# Altium schematic sheet Eink_Smartwatch_v1.SchDoc
size A2; SheetNumber: 1; SheetTotal: 1
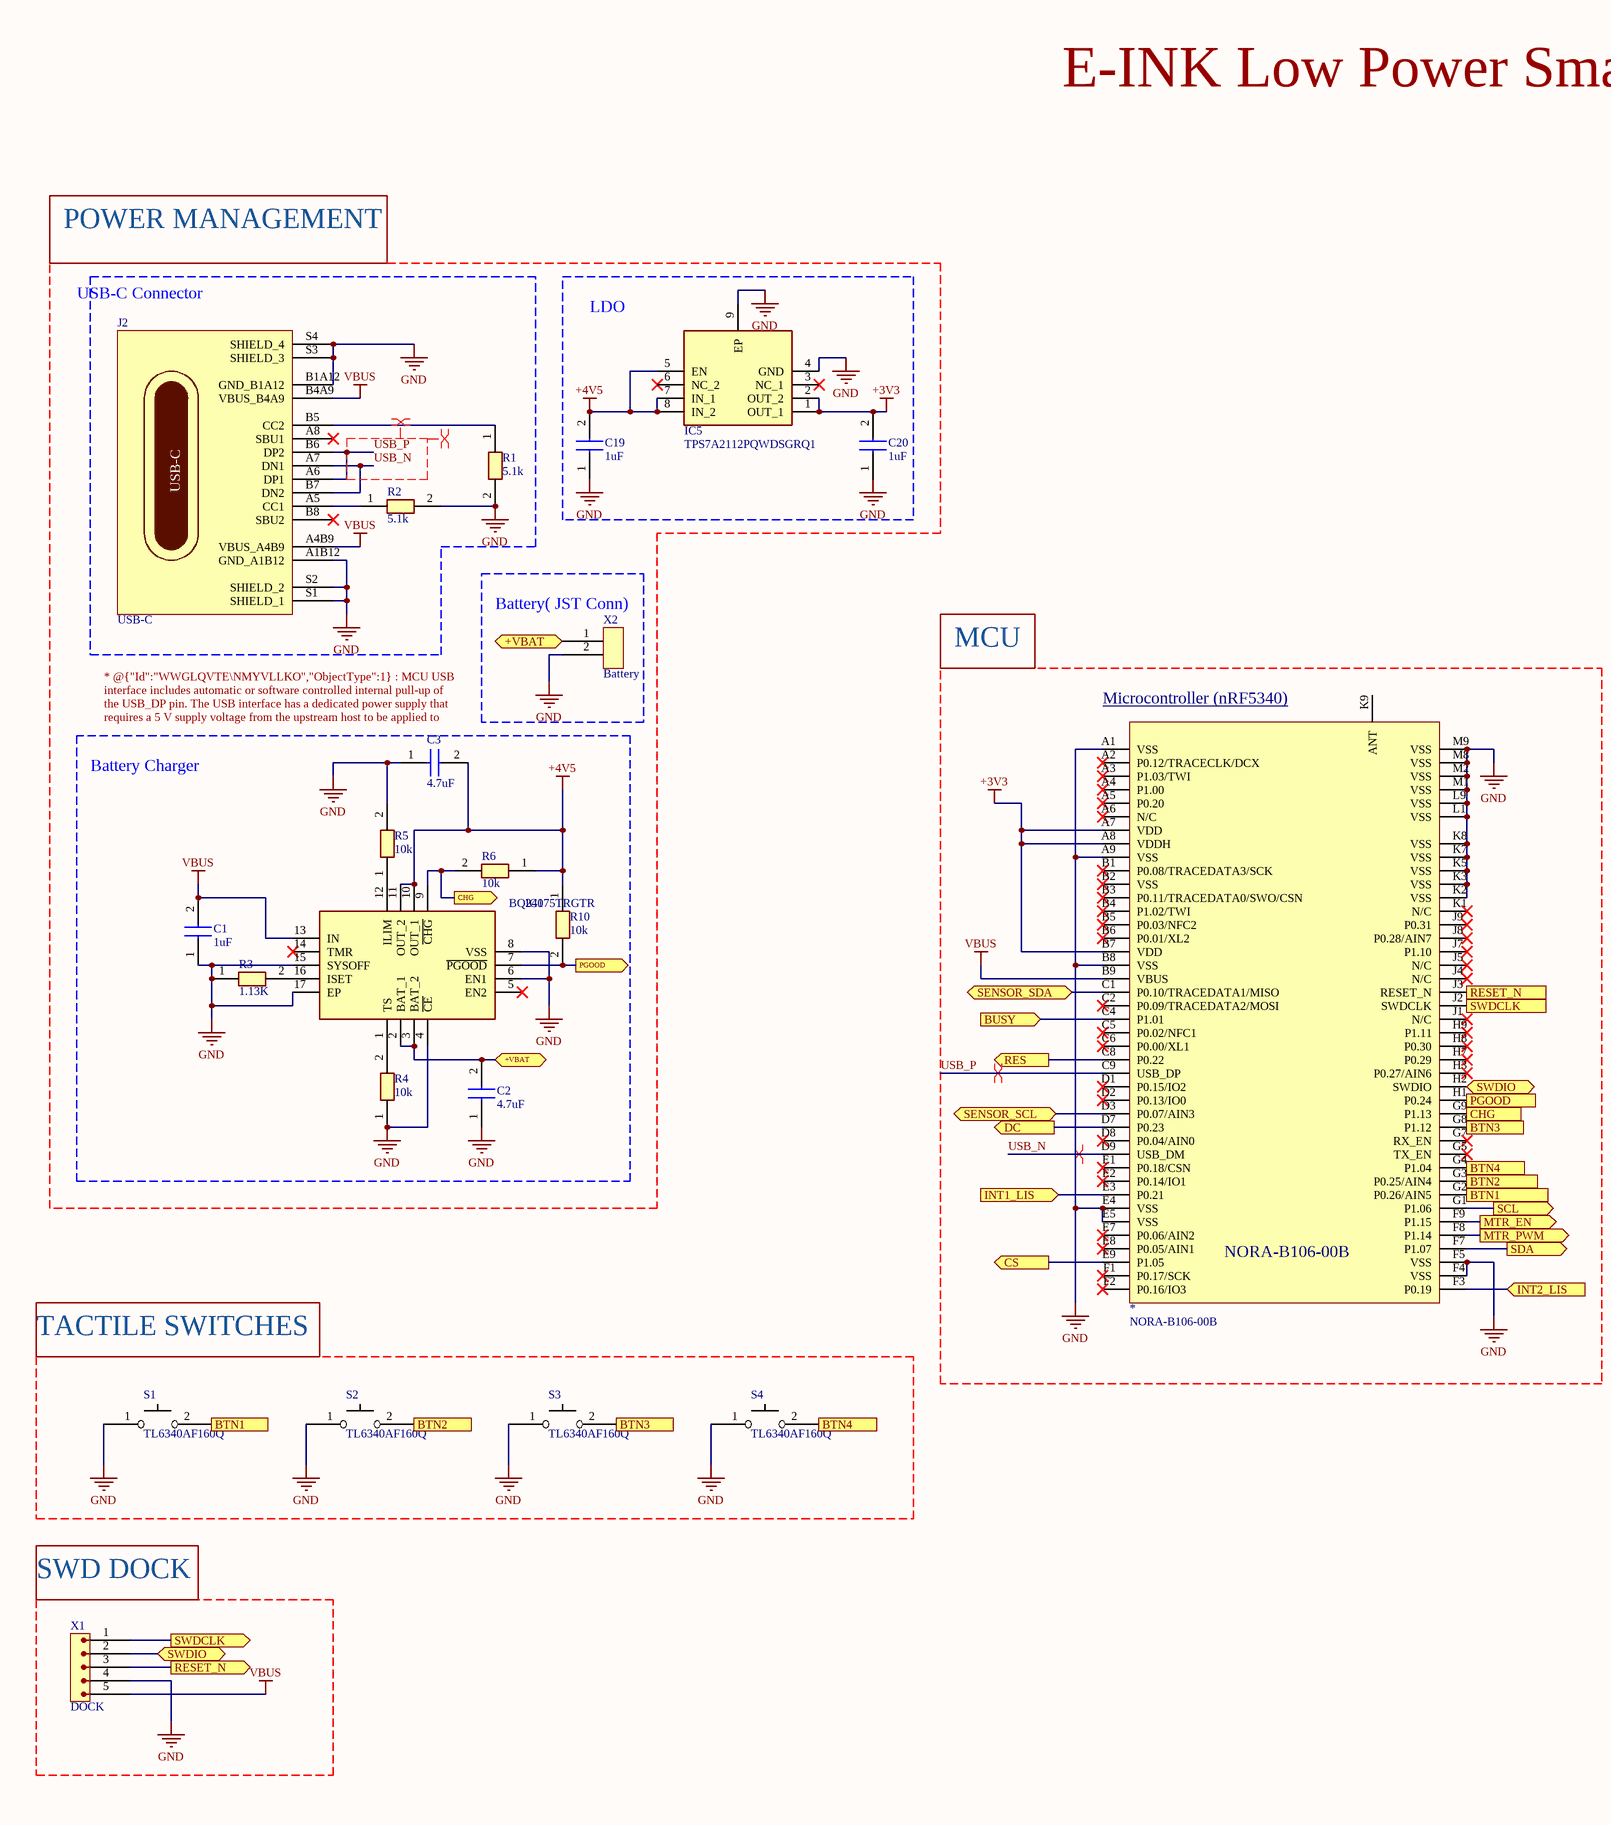
[diagram p0: Eink_Smartwatch_v1.SchDoc, left]
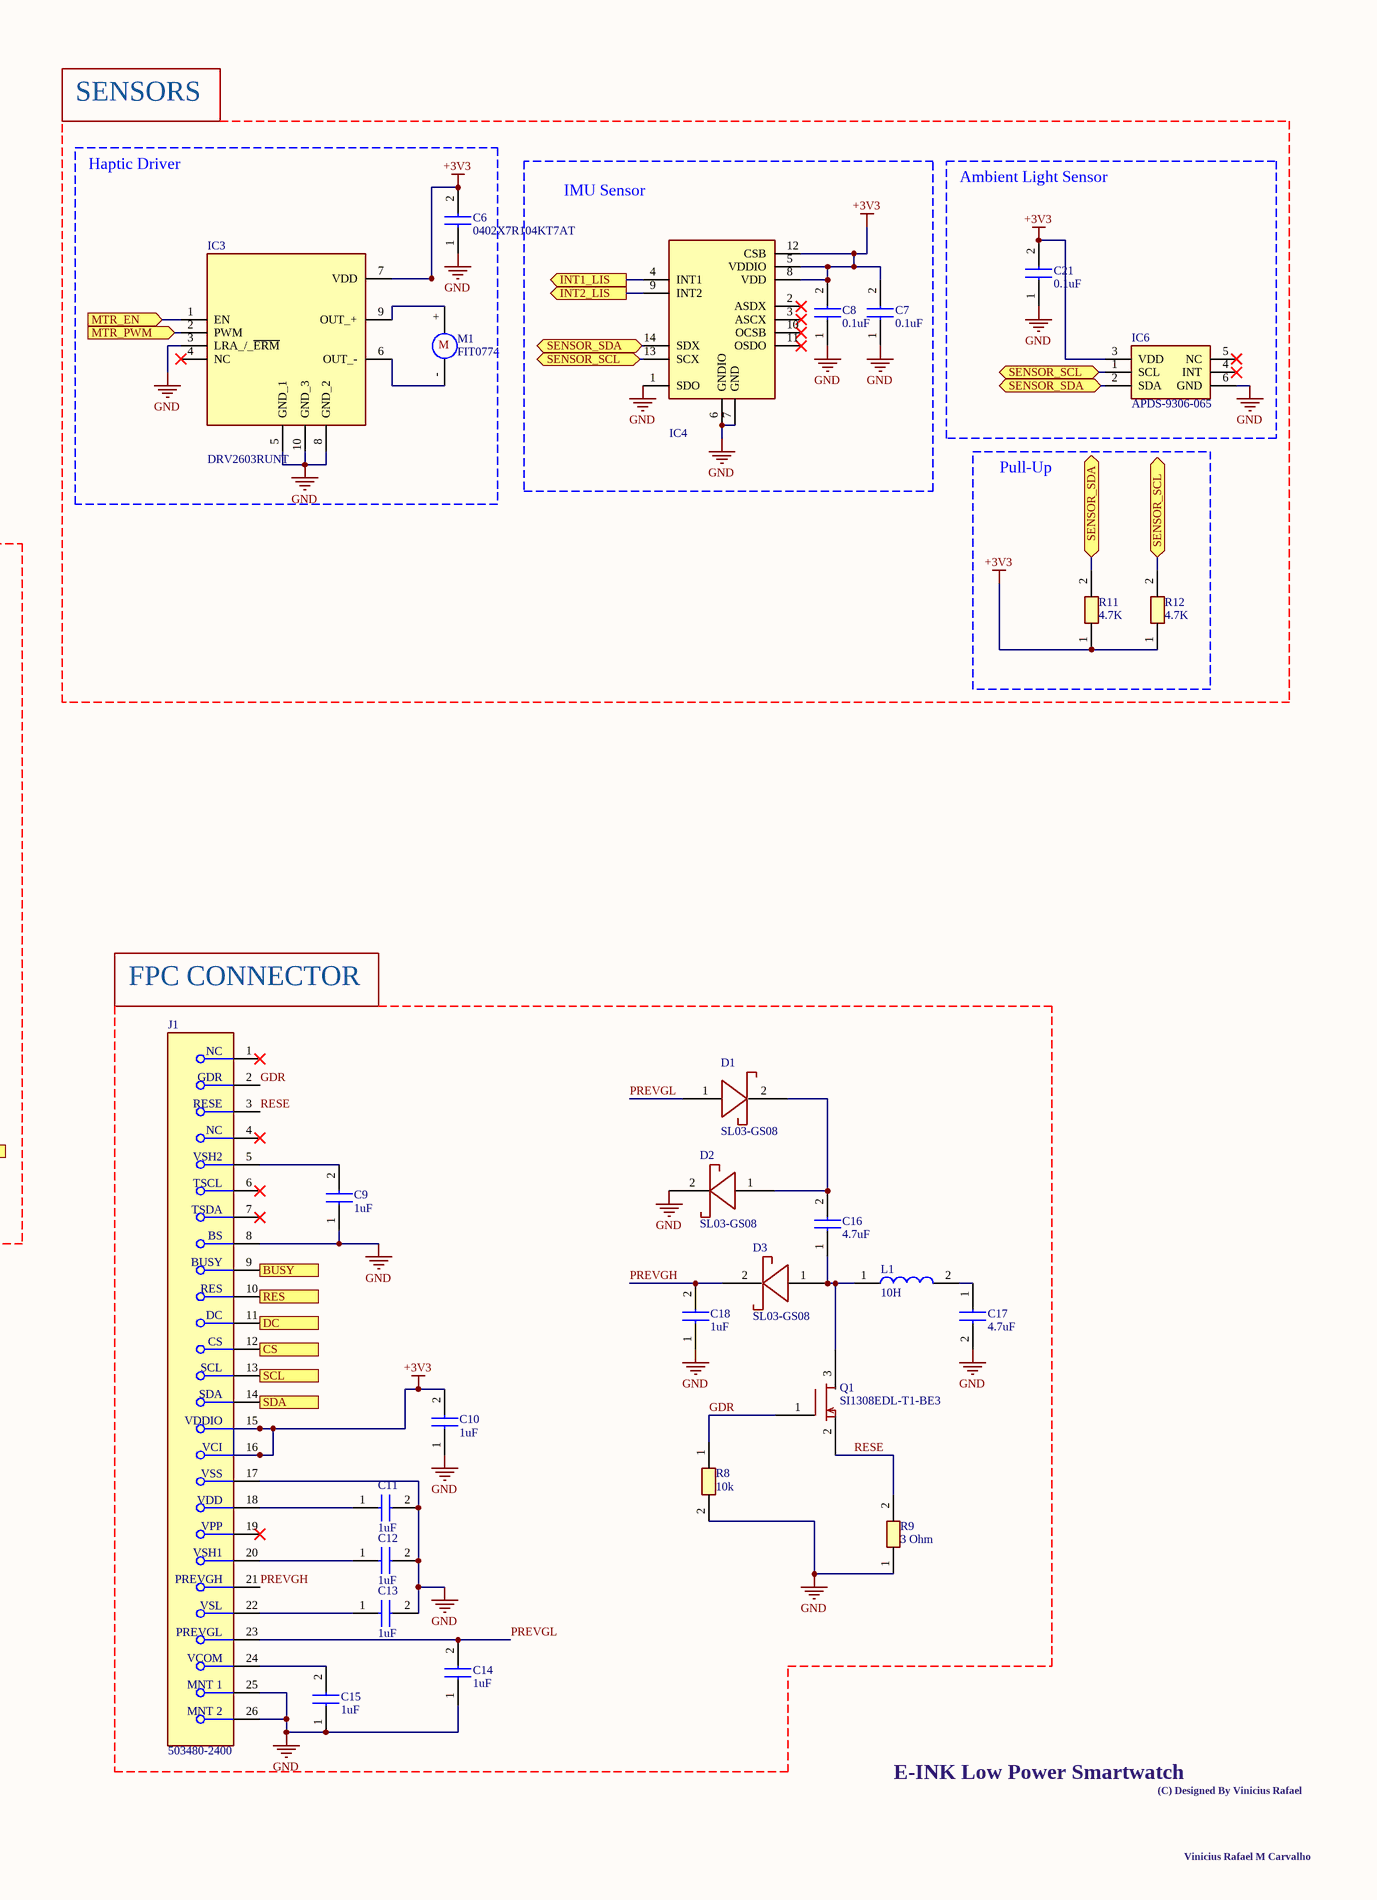
[diagram p1: Eink_Smartwatch_v1.SchDoc, right]

## Parts
*  NORA-B106-00B  [XCVR_NORA-B106-00B]
C1  1uF  [CAPC1005X65N]
C2  4.7uF  [CAPC1005X65N]
C3  4.7uF  [CAPC1005X65N]
C6  0402X7R104KT7AT  [CAPC1005X61N]
C7  0.1uF  [CAPC1005X61N]
C8  0.1uF  [CAPC1005X61N]
C9  1uF  [CAPC1005X65N]
C10  1uF  [CAPC1005X65N]
C11  1uF  [CAPC1005X65N]
C12  1uF  [CAPC1005X65N]
C13  1uF  [CAPC1005X65N]
C14  1uF  [CAPC1005X65N]
C15  1uF  [CAPC1005X65N]
C16  4.7uF  [CAPC1005X65N]
C17  4.7uF  [CAPC1005X65N]
C18  1uF  [CAPC1005X65N]
C19  1uF  [CAPC1005X65N]
C20  1uF  [CAPC1005X65N]
C21  0.1uF  [CAPC1005X61N]
D1  SL03-GS08  [SODFL3718X108N]
D2  SL03-GS08  [SODFL3718X108N]
D3  SL03-GS08  [SODFL3718X108N]
IC1  BQ24075TRGTR  [QFN50P300X300X100-17N-D]
IC3  DRV2603RUNT  [QFN50P200X200X80-10N-D]
IC4  BMI270  [BMI270]  (value not drawn)
IC5  TPS7A2112PQWDSGRQ1  [SON50P200X200X80-9N]
IC6  APDS-9306-065  [APDS9306065]
J1  503480-2400  [MOLEX_5034802400]
J2  USB-C  [FP-2171790001-MFG]
L1  10H  [DFE2HCAH1R0MJ0L]
M1  FIT0774  [FIT0774]
Q1  SI1308EDL-T1-BE3  [SI1308EDL-T1-BE3]
R1  5.1k  [RESC1005X40]
R2  5.1k  [RESC1005X40]
R3  1.13K  [RESC1005X37N]
R4  10k  [RESC1005X37N]
R5  10k  [RESC1005X37N]
R6  10k  [RESC1005X37N]
R8  10k  [RESC1005X37N]
R9  3 Ohm  [RESC1508X50N]
R10  10k  [RESC1005X37N]
R11  4.7K  [ERJPA2_(0402)]
R12  4.7K  [ERJPA2_(0402)]
S1  TL6340AF160Q  [SW_TL6340AF160Q]
S2  TL6340AF160Q  [SW_TL6340AF160Q]
S3  TL6340AF160Q  [SW_TL6340AF160Q]
S4  TL6340AF160Q  [SW_TL6340AF160Q]
X1  DOCK  [SAMTEC_FTSH-105-XX-X-DV]
X2  Battery  [JST_PHR-2]

## Blocks framed on the sheet
LDO: C19 C20 IC5
Haptic Driver: C6 IC3 M1
IMU Sensor: C7 C8 IC4
Ambient Light Sensor: C21 IC6
Battery( JST Conn): X2
Pull-Up: R11 R12
MCU: *
Battery Charger: C1-C3 IC1 R3-R6 R10
TACTILE SWITCHES: S1-S4
SWD DOCK: X1

## Ports
+VBAT (bidir, see Eink_Smartwatch_v1[2B]), +VBAT (bidir, see Eink_Smartwatch_v1[2C]), BTN1 (in, see Eink_Smartwatch_v1[1C]), BTN1 (out, see Eink_Smartwatch_v1[5C]), BTN2 (in, see Eink_Smartwatch_v1[2C]), BTN2 (out, see Eink_Smartwatch_v1[5C]), BTN3 (in, see Eink_Smartwatch_v1[2C]), BTN3 (out, see Eink_Smartwatch_v1[5C]), BTN4 (in, see Eink_Smartwatch_v1[3C]), BTN4 (out, see Eink_Smartwatch_v1[5C]), BUSY (in, see Eink_Smartwatch_v1[6C]), BUSY (out, see Eink_Smartwatch_v1[3C]), CHG (in, see Eink_Smartwatch_v1[2B]), CHG (out, see Eink_Smartwatch_v1[5C]), CS (in, see Eink_Smartwatch_v1[3C]), CS (out, see Eink_Smartwatch_v1[6C]), DC (in, see Eink_Smartwatch_v1[3C]), DC (out, see Eink_Smartwatch_v1[6C]), INT1_LIS (in, see Eink_Smartwatch_v1[6A]), INT1_LIS (out, see Eink_Smartwatch_v1[3C]), INT2_LIS (in, see Eink_Smartwatch_v1[6A]), INT2_LIS (out, see Eink_Smartwatch_v1[5C]), MTR_EN (in, see Eink_Smartwatch_v1[5C]), MTR_EN (out, see Eink_Smartwatch_v1[5A]), MTR_PWM (in, see Eink_Smartwatch_v1[5C]), MTR_PWM (out, see Eink_Smartwatch_v1[5A]), PGOOD (in, see Eink_Smartwatch_v1[2B]), PGOOD (out, see Eink_Smartwatch_v1[5C]), RES (in, see Eink_Smartwatch_v1[3C]), RES (out, see Eink_Smartwatch_v1[6C]), RESET_N (in, see Eink_Smartwatch_v1[1D]), RESET_N (out, see Eink_Smartwatch_v1[5B]), SCL (in, see Eink_Smartwatch_v1[5C]), SCL (out, see Eink_Smartwatch_v1[6C]), SDA (in, see Eink_Smartwatch_v1[5C]), SDA (out, see Eink_Smartwatch_v1[6D]), SENSOR_SCL (bidir, see Eink_Smartwatch_v1[3C], Eink_Smartwatch_v1[6B], Eink_Smartwatch_v1[8B]), SENSOR_SCL (bidir, see Eink_Smartwatch_v1[3C], Eink_Smartwatch_v1[8B]), SENSOR_SCL (bidir, see Eink_Smartwatch_v1[6B], Eink_Smartwatch_v1[8B]), SENSOR_SDA (bidir, see Eink_Smartwatch_v1[3B], Eink_Smartwatch_v1[6A], Eink_Smartwatch_v1[8B]), SENSOR_SDA (bidir, see Eink_Smartwatch_v1[3B], Eink_Smartwatch_v1[8B]), SENSOR_SDA (bidir, see Eink_Smartwatch_v1[6A], Eink_Smartwatch_v1[8B]), SWDCLK (in, see Eink_Smartwatch_v1[1D]), SWDCLK (out, see Eink_Smartwatch_v1[5C]), SWDIO (bidir, see Eink_Smartwatch_v1[1D]), SWDIO (bidir, see Eink_Smartwatch_v1[5C])

## Nets
+3V3: *.A7(VDD) *.A8(VDDH) *.B7(VDD) C6.2 C7.2 C8.2 C10.2 C20.2 C21.2 IC3.7(VDD) IC4.5(VDDIO) IC4.8(VDD) IC4.12(CSB) IC5.1(OUT_1) IC5.2(OUT_2) IC6.3(VDD) J1.15 J1.16 R11.1 R12.1
+4V5: C3.2 C19.2 IC1.10(OUT_1) IC1.11(OUT_2) IC5.5(EN) IC5.7(IN_1) IC5.8(IN_2) R6.1 R10.1
GND: *.A1(VSS) *.A9(VSS) *.B8(VSS) *.E4(VSS) *.E5(VSS) *.F4(VSS) *.F5(VSS) *.K2(VSS) *.K3(VSS) *.K5(VSS) *.K7(VSS) *.K8(VSS) *.L1(VSS) *.L9(VSS) *.M1(VSS) *.M2(VSS) *.M8(VSS) *.M9(VSS) C1.1 C2.1 C3.1 C6.1 C7.1 C8.1 C9.1 C10.1 C11.2 C12.2 C13.2 C14.1 C15.1 C17.2 C18.1 C19.1 C20.1 C21.1 D2.2 IC1.4(~{CE}) IC1.6(EN1) IC1.8(VSS) IC1.15(SYSOFF) IC1.17(EP) IC3.3(LRA_/_~{ERM}) IC3.5(GND_1) IC3.8(GND_2) IC3.10(GND_3) IC4.1(SDO) IC4.6(GNDIO) IC4.7(GND) IC5.4(GND) IC5.9(EP) IC6.6(GND) J1.8 J1.17 J1.25(MNT_1) J1.26(MNT_2) J2.A1B12(GND_A1B12) J2.B1A12(GND_B1A12) J2.S1(SHIELD_1) J2.S2(SHIELD_2) J2.S3(SHIELD_3) J2.S4(SHIELD_4) R1.2 R2.2 R3.1 R4.1 R5.2 R8.2 R9.1 S1.1 S2.1 S3.1 S4.1 X1.4 X2.2
VBUS: *.B9(VBUS) C1.2 IC1.13(IN) J2.A4B9(VBUS_A4B9) J2.B4A9(VBUS_B4A9) X1.5
+VBAT: C2.2 IC1.2(BAT_1) IC1.3(BAT_2) X2.1 ; port +VBAT
BTN1: *.G2(P0.26/AIN5) S1.2 ; port BTN1
BTN2: *.G3(P0.25/AIN4) S2.2 ; port BTN2
BTN3: *.G8(P1.12) S3.2 ; port BTN3
BTN4: *.G4(P1.04) S4.2 ; port BTN4
BUSY: *.C4(P1.01) J1.9 ; port BUSY
CHG: *.G9(P1.13) IC1.9(~{CHG}) R6.2 ; port CHG
CS: *.E9(P1.05) J1.12 ; port CS
DC: *.D7(P0.23) J1.11 ; port DC
GDR: J1.2 Q1.1 R8.1
INT1_LIS: *.E3(P0.21) IC4.4(INT1) ; port INT1_LIS
INT2_LIS: *.F3(P0.19) IC4.9(INT2) ; port INT2_LIS
MTR_EN: *.F9(P1.15) IC3.1(EN) ; port MTR_EN
MTR_PWM: *.F8(P1.14) IC3.2(PWM) ; port MTR_PWM
PGOOD: *.H1(P0.24) IC1.7(~{PGOOD}) R10.2 ; port PGOOD
PREVGH: C18.2 D3.2 J1.21
PREVGL: C14.2 D1.1 J1.23
RES: *.C8(P0.22) J1.10 ; port RES
RESE: J1.3 Q1.2 R9.2
RESET_N: *.J3(RESET_N) X1.3 ; port RESET_N
SCL: *.G1(P1.06) J1.13 ; port SCL
SDA: *.F7(P1.07) J1.14 ; port SDA
SENSOR_SCL: *.D3(P0.07/AIN3) IC4.13(SCX) IC6.1(SCL) R12.2 ; port SENSOR_SCL
SENSOR_SDA: *.C1(P0.10/TRACEDATA1/MISO) IC4.14(SDX) IC6.2(SDA) R11.2 ; port SENSOR_SDA
SWDCLK: *.J2(SWDCLK) X1.1 ; port SWDCLK
SWDIO: *.H2(SWDIO) X1.2 ; port SWDIO
USB_N: *.D9(USB_DM) J2.A7(DN1) J2.B7(DN2)
USB_P: *.C9(USB_DP) J2.A6(DP1) J2.B6(DP2)
NetC9_2: C9.2 J1.5
NetC11_1: C11.1 J1.18
NetC12_1: C12.1 J1.20
NetC13_1: C13.1 J1.22
NetC15_2: C15.2 J1.24
NetC16_1: C16.1 D3.1 L1.1 Q1.3
NetC16_2: C16.2 D1.2 D2.1
NetC17_1: C17.1 L1.2
NetIC1_1: IC1.1(TS) R4.2
NetIC1_12: IC1.12(ILIM) R5.1
NetIC1_16: IC1.16(ISET) R3.2
NetIC3_6: IC3.6(OUT_-) M1.-
NetIC3_9: IC3.9(OUT_+) M1.+
NetJ2_A5: J2.A5(CC1) R2.1
NetJ2_B5: J2.B5(CC2) R1.1

Not connected (* = marked no-connect by the designer): * A2(P0.12/TRACECLK/DCX)* A3(P1.03/TWI)* A4(P1.00)* A5(P0.20)* A6(N/C)* B1(P0.08/TRACEDATA3/SCK)* B2(VSS)* B3(P0.11/TRACEDATA0/SWO/CSN)* B4(P1.02/TWI)* B5(P0.03/NFC2)* B6(P0.01/XL2)* C2(P0.09/TRACEDATA2/MOSI)* C5(P0.02/NFC1)* C6(P0.00/XL1)* D1(P0.15/IO2)* D2(P0.13/IO0)* D8(P0.04/AIN0)* E1(P0.18/CSN)* E2(P0.14/IO1)* E7(P0.06/AIN2)* E8(P0.05/AIN1)* F1(P0.17/SCK)* F2(P0.16/IO3)* G5(TX_EN)* G7(RX_EN)* H3(P0.27/AIN6)* H7(P0.29)* H8(P0.30)* H9(P1.11)* J1(N/C)* J4(N/C)* J5(N/C)* J7(P1.10)* J8(P0.28/AIN7)* J9(P0.31)* K1(N/C)* K9(ANT); IC1 5(EN2)* 14(TMR)*; IC3 4(NC)*; IC4 2(ASDX)* 3(ASCX)* 10(OCSB)* 11(OSDO)*; IC5 3(NC_1)* 6(NC_2)*; IC6 4(INT)* 5(NC)*; J1 1* 4* 6* 7* 19*; J2 A8(SBU1)* B8(SBU2)*

## Layout directives
differential pair: USB_N, USB_P
differential pair; differential pair class DIFF90: USB_N, USB_P
net class DIFF90: USB_N, USB_P

## Notes on the sheet
- E-INK Low Power Smartwatch
- POWER MANAGEMENT
- SENSORS
- USB-C Connector
- (near C3) * @{"Id":"WWGLQVTE\NMYVLLKO","ObjectType":1} : MCU USB interface includes automatic or software controlled internal pull-up of the USB_DP pin. The USB interface has a dedicated power supply that requires a 5 V supply voltage from the upstream host to be applied to the VBUS pin.
- (near *) Microcontroller (nRF5340) <https://br.mouser.com/datasheet/2/1025/NORA_B1_DataSheet_UBX_20027119-3180474.pdf>
- FPC CONNECTOR
- (C) Designed By Vinicius Rafael
- Vinicius Rafael M Carvalho
- (in symbol CMP-00257-81652754-1) NC; GDR; RESE; VSH2; TSCL; TSDA; BS; BUSY; RES; DC; CS; SCL; SDA; VDDIO; VCI; VSS; VDD; VPP; VSH1; PREVGH; VSL; PREVGL; VCOM
- (in symbol FIT0774) M

## Library data of the parts
* = NORA-B106-00B: Bluetooth Modules - 802.15.1 nRF5340, PCB antenna, open CPU; Manufacturer: u-blox; Supplier: Mouser; Supplier Part Number: 377-NORA-B106-00B; Manufacturer Part Number: NORA-B106-00B; RoHS: No; Category: LDO; Stock: 4440; Pricing: 1=14, 10=12,74, 50=11,72, 100=10,9, 1000=10,9, 10000=10,9 (USD); ComponentLink1URL: https://datasheet.octopart.com/NORA-B106-00B-u-blox-datasheet-166811452.pdf?src-supplier=TME; ComponentLink1Description: https://datasheet.octopart.com/NORA-B106-00B-u-blox-datasheet-166811452.pdf?src-supplier=TME
C1 C9-C15 C18-C20 = CC0402KRX5R6BB105: Multilayer Ceramic Capacitors MLCC - SMD/SMT 10V 1uF X5R 0402 10% HI CV; Manufacturer_Name: YAGEO; Datasheet Link: https://www.yageo.com/upload/media/product/app/datasheet/mlcc/upy-gphc_x5r_4v-to-50v.pdf; Height: 0.55mm; Manufacturer_Part_Number: CC0402KRX5R6BB105; Mouser Part Number: 603-CC402KRX5R6BB105; Mouser Price/Stock: https://www.mouser.co.uk/ProductDetail/YAGEO/CC0402KRX5R6BB105?qs=BKNoF%2F0xMNu0TvpE6ze2Iw%3D%3D; Arrow Part Number: CC0402KRX5R6BB105; Arrow Price/Stock: https://www.arrow.com/en/products/cc0402krx5r6bb105/yageo?region=nac
C2 C3 C16 C17 = GRM31CR61A475KA01L: Multilayer Ceramic Capacitors MLCC - SMD/SMT 4.7 uF 10 VDC 20% 0402 X5R; Manufacturer_Name: Murata Electronics; Datasheet Link: http://www.murata.com/~/media/webrenewal/support/library/catalog/products/capacitor/mlcc/c02e.pdf; Height: 1.8mm; Manufacturer_Part_Number: GRM31CR61A475KA01L; Mouser Part Number: 81-GRM426R475K10L; Mouser Price/Stock: https://www.mouser.co.uk/ProductDetail/Murata-Electronics/GRM31CR61A475KA01L?qs=v6FXEKp3YeVDfOIVbbYCqg%3D%3D; Arrow Part Number: GRM31CR61A475KA01L; Arrow Price/Stock: https://www.arrow.com/en/products/grm31cr61a475ka01l/murata-manufacturing
C6-C8 C21 = 0402X7R104KT7AT: Multilayer Ceramic Capacitors MLCC - SMD/SMT 16V 0.1uF X7R 10%; Manufacturer_Name: Kyocera AVX; Datasheet Link: https://www.mouser.es/datasheet/2/40/general_purpose-3169586.pdf; Height: 0.61mm; Manufacturer_Part_Number: 0402X7R104KT7AT; Mouser Part Number: 581-0402X7R104KT7AT; Mouser Price/Stock: https://www.mouser.co.uk/ProductDetail/KYOCERA-AVX/0402X7R104KT7AT?qs=DPoM0jnrROXD467pFR2ukA%3D%3D
D1-D3 = SL03-GS08: Rectifier Diode, Schottky, 1 Phase, 1 Element, 1.1A, 30V V(RRM), Silicon, DO-219AB; Manufacturer: Vishay Semiconductors; Package Body Material: Plastic; Application(s): EFFICIENCY; Forward Voltage: 430mV; Non-rep Pk Forward Current-Max: 40A; Number of Elements: 1; Qualification Status: Not Qualified; Supplier: Mouser; Supplier Part Number: 625-SL03; Manufacturer Part Number: SL03-GS08; RoHS: Yes; Category: Rectifier Diodes; Stock: 88607; Pricing: 1=0,41, 10=0,274, 50=0,339, 100=0,185, 500=0,144, 1000=0,13, 3000=0,099, 9000=0,089, 10000=0,092, 24000=0,087 (USD); Pins: 2; Diode Element Material: SILICON; Package Shape: Rectangular; Terminal Finish: Tin; Max Operating Temperature: 125°C; JESD-609 Code: e3; Diode Type: RECTIFIER; JESD-30 Code: R-PDSO-F2; Moisture Sensitivity Level: 1; Number of Phases: 1; Max Output current: 1.1A; Package Style: SMALL OUTLINEMeter; Rep Pk Reverse Voltage-Max: 30V; Surface Mount: Yes; Technology: SCHOTTKY; Terminal Form: Flat; Terminal Position: DUAL; JEDEC-95 Code: DO-219AB; RoHS Compliant: Yes; Reach SVHC Compliant: No; ComponentLink1URL: https://datasheet.ciiva.com:443/pdfs/VipMasterIC/IC/VISH/VISH-S-A0009169378/VISH-S-A0009169378-1.pdf?src-supplier=IHS+Markit; ComponentLink1Description: https://datasheet.ciiva.com:443/pdfs/VipMasterIC/IC/VISH/VISH-S-A0009169378/VISH-S-A0009169378-1.pdf?src-supplier=IHS+Markit; ComponentLink2URL: https://datasheet.ciiva.com/910/sl02-03-04-910861.pdf?src-supplier=Digikey; ComponentLink2Description: https://datasheet.ciiva.com/910/sl02-03-04-910861.pdf?src-supplier=Digikey; ComponentLink3URL: https://datasheet.ciiva.com/910/sl02-910862.pdf?src-supplier=Digikey; ComponentLink3Description: https://datasheet.ciiva.com/910/sl02-910862.pdf?src-supplier=Digikey; ComponentLink4URL: https://datasheet.ciiva.com/910/sl02-910863.pdf?src-supplier=Digikey; ComponentLink4Description: https://datasheet.ciiva.com/910/sl02-910863.pdf?src-supplier=Digikey; ComponentLink5URL: https://datasheet.ciiva.com/8290/sl02-8290522.pdf?src-supplier=Avnet; ComponentLink5Description: https://datasheet.ciiva.com/8290/sl02-8290522.pdf?src-supplier=Avnet; ComponentLink6URL: https://datasheet.ciiva.com/16486/sl02-16486940.pdf?src-supplier=Future+Electronics; ComponentLink6Description: https://datasheet.ciiva.com/16486/sl02-16486940.pdf?src-supplier=Future+Electronics
IC1 = BQ24075TRGTR: Gerenciadores de bateria 1.5A USB-Friendly Li Ion Batt Charger; Manufacturer_Name: Texas Instruments; Datasheet Link: http://componentsearchengine.com/Datasheets/1/BQ24075TRGTR.pdf; Height: 1mm; Manufacturer_Part_Number: BQ24075TRGTR; Mouser Part Number: 595-BQ24075TRGTR; Mouser Price/Stock: https://www.mouser.co.uk/ProductDetail/Texas-Instruments/BQ24075TRGTR?qs=%2Fqzd9s%252BcLd4uxZAT5jNskQ%3D%3D; Arrow Part Number: BQ24075TRGTR; Arrow Price/Stock: https://www.arrow.com/en/products/bq24075trgtr/texas-instruments?region=nac
IC3 = DRV2603RUNT: Motor / Motion / Ignition Controllers & Drivers Haptic Driver w/Auto Resonance Tracking; Manufacturer_Name: Texas Instruments; Datasheet Link: http://www.ti.com/lit/ds/symlink/drv2603.pdf; Height: 0.8mm; Manufacturer_Part_Number: DRV2603RUNT; Mouser Part Number: 595-DRV2603RUNT; Mouser Price/Stock: https://www.mouser.co.uk/ProductDetail/Texas-Instruments/DRV2603RUNT?qs=y0LsnOHuQQ66fXxKAgGo4A%3D%3D; Arrow Part Number: DRV2603RUNT; Arrow Price/Stock: https://www.arrow.com/en/products/drv2603runt/texas-instruments
IC4 = BMI270: IMUs - Inertial Measurement Units Smart Ultra-Low Power Inertial Measurement Unit (IMU) for Wearable Applications; Manufacturer_Name: BOSCH; Datasheet Link: https://www.bosch-sensortec.com/media/boschsensortec/downloads/datasheets/bst-bmi270-ds000.pdf; Height: 0.87mm; Manufacturer_Part_Number: BMI270; Mouser Part Number: 262-BMI270; Mouser Price/Stock: https://www.mouser.co.uk/ProductDetail/Bosch-Sensortec/BMI270?qs=u16ybLDytRYIj%252BjQEee88A%3D%3D; Arrow Part Number: BMI270; Arrow Price/Stock: https://www.arrow.com/en/products/bmi270/bosch?utm_currency=USD&region=nac
IC5 = TPS7A2112PQWDSGRQ1: LDO Voltage Regulators Automotive, 500mA, low-noise ultra-low-IQ high-PSRR low-dropout (LDO) voltage regulator; Manufacturer_Name: Texas Instruments; Datasheet Link: https://www.ti.com/lit/gpn/tps7a21-q1; Height: 0.8mm; Manufacturer_Part_Number: TPS7A2112PQWDSGRQ1
IC6 = APDS-9306-065: Ambient Light Sensors Digital Ambient Light Sensor; Manufacturer_Name: Avago Technologies; Datasheet Link: A19870331a; Height: 0.75mm; Manufacturer_Part_Number: APDS-9306-065; Mouser Part Number: 630-APDS-9306-065; Mouser Price/Stock: https://www.mouser.co.uk/ProductDetail/Broadcom-Avago/APDS-9306-065?qs=JUmsgfbaopRTut8Cx4p19A%3D%3D
J1 = CMP-00257-81652754-1: 503480-2400 Molex 503480-2400 FFC & FPC Connectors, 0.5mm, FPC Ra Smt Dual Cont 24 Circuit,; Manufacturer Lifecycle Status: ACTIVE; Number of Contacts: 24; Voltage Rating: 50V; Plating: Gold; Current Rating: 500mA; Contact Plating: Gold; Mount: Surface Mount; Country of Origin: KR; Number of Rows: 1; Orientation: Right Angle; Lifecycle Status: Production; RoHS: Compliant; Min Operating Temperature: -40°C; Contact Material: Gold, Nickel; Max Operating Temperature: 85°C; Height: 2.07mm; Number of Circuits: 24; NexarPartId: 81652754
J2 = 217179-0001: USB Connector, 16 Contact(s), Female, Right Angle, Surface Mount Terminal, Locking, Receptacle; Manufacturer: Molex; Supplier: Mouser; Supplier Part Number: 538-217179-0001; Manufacturer Part Number: 217179-0001; RoHS: No; Category: USB Connectors; Stock: 4841; Pricing: 1=0,9, 10=0,745, 50=0,745, 100=0,622, 1000=0,622, 10000=0,446 (USD)
L1 = 1239AS-H-100M=P2: Indutores de potência - SMD 10 UH 20%; Manufacturer_Name: Murata Electronics; Datasheet Link: https://psearch.en.murata.com/inductor/product/1239AS-H-100M%23.html; Height: 1.2mm; Manufacturer_Part_Number: 1239AS-H-100M=P2; Mouser Part Number: 81-1239AS-H-100MP2; Mouser Price/Stock: https://www.mouser.co.uk/ProductDetail/Murata-Electronics/1239AS-H-100M%3dP2?qs=KuGPmAKtFKWZyoO25uKvSg%3D%3D; Arrow Part Number: 1239AS-H-100M=P2; Arrow Price/Stock: https://www.arrow.com/en/products/1239as-h-100mp2/murata-manufacturing?region=nac
M1 = FIT0774: Mini Vibration Motor (10*2.7MM); Manufacturer: DFRobot; Supplier: Mouser; Supplier Part Number: 426-FIT0774; Manufacturer Part Number: FIT0774; RoHS: No; Category: Motors and Drives; Stock: 3316; Pricing: 1=0,99, 10=0,99, 50=0,99, 100=0,99, 1000=0,99, 10000=0,99 (USD)
Q1 = SI1308EDL-T1-BE3: Transistor MOSFET N-Channel 30V 1.4A 3-Pin SOT-323; Manufacturer: Vishay; Supplier: Mouser; Supplier Part Number: 78-SI1308EDL-T1-BE3; Manufacturer Part Number: SI1308EDL-T1-BE3; RoHS: No; Stock: 79433; Pricing: 1=0,4, 10=0,276, 50=0,276, 100=0,172, 1000=0,129, 10000=0,098 (USD); ComponentLink1URL: https://datasheet.octopart.com/SI1308EDL-T1-BE3-Vishay-datasheet-151651462.pdf?src-supplier=Future+Electronics; ComponentLink1Description: https://datasheet.octopart.com/SI1308EDL-T1-BE3-Vishay-datasheet-151651462.pdf?src-supplier=Future+Electronics
R1 R2 = ERJ-2RHD512X: Fixed Resistor, Metal Glaze/thick Film, 0.063W, 5110ohm, 50V, 0.5% +/-Tol, 50ppm/Cel, Surface Mount, 0402; Manufacturer: Panasonic; Manufacturer Series: ERJ2R; Power: 63mW; Rated Temperature: 70°C; Value: 5.11kR; Temperature Coefficient: 50ppm/°C; Supplier: Mouser; Supplier Part Number: 667-ERJ-2RHD512X; Manufacturer Part Number: ERJ-2RHD512X; RoHS: Yes; Stock: 18329; Pricing: 1=0,13, 10=0,11, 50=0,11, 100=0,043, 1000=0,019, 10000=0,019 (USD); Mounting Technology: Surface Mount; Pins: 2; Package Shape: Rectangular; Case/Package: 0402; Terminal Finish: Tin; Min Operating Temperature: -55°C; Max Operating Temperature: 125°C; Tolerance: 0.5%; JESD-609 Code: e3; Resistor Type: FIXED RESISTOR; Packaging: Tape and Reel; Technology: METAL GLAZE/THICK FILM; Termination: Wraparound; Working Voltage: 50V; Reach SVHC Compliant: Yes; RoHS Compliant: Yes; ComponentLink1URL: https://datasheet.ciiva.com:443/pdfs/VipMasterCap/Capacitor/PANA/PANAS11022/PANAS11022-1.pdf?src-supplier=IHS+Markit; ComponentLink1Description: https://datasheet.ciiva.com:443/pdfs/VipMasterCap/Capacitor/PANA/PANAS11022/PANAS11022-1.pdf?src-supplier=IHS+Markit; ComponentLink2URL: https://datasheet.ciiva.com/24037/aoa0000ce2-24037669.pdf?src-supplier=Mouser; ComponentLink2Description: https://datasheet.ciiva.com/24037/aoa0000ce2-24037669.pdf?src-supplier=Mouser
R3 = AF0402FR-071K13L: Fixed Resistor, Metal Glaze/thick Film, 0.0625W, 1130ohm, 50V, 1% +/-Tol, 100ppm/Cel, Surface Mount, 0402; Manufacturer: Yageo; Additional Feature: ANTI-SULFUR; Power: 62.5mW; Rated Temperature: 70°C; Value: 1.13kR; Temperature Coefficient: 100ppm/°C; Package Height: 0.32mm; Package Length: 1mm; Package Width: 0.5mm; Reference Standard: AEC-Q200; Supplier: Mouser; Supplier Part Number: 603-AF0402FR-071K13L; Manufacturer Part Number: AF0402FR-071K13L; RoHS: Yes; Category: Chip SMD Resistors; Stock: 3100; Pricing: 1=0,15, 10=0,037, 50=0,037, 100=0,02, 1000=0,012, 10000=0,006 (USD); Mounting Technology: Surface Mount; Pins: 2; Case/Package: 0402; Min Operating Temperature: -55°C; Max Operating Temperature: 155°C; Tolerance: 1%; Resistor Type: FIXED RESISTOR; Construction: Rectangular; Package Style: SMTMeter; Packaging: Tape and Reel; Termination: Wraparound; Working Voltage: 50V; Reach SVHC Compliant: Yes; RoHS Compliant: Yes; ComponentLink1URL: https://datasheet.ciiva.com:443/pdfs/VipMasterIC/IC/YAGO/YAGO-S-A0009016998/YAGO-S-A0009016998-1.pdf?src-supplier=IHS+Markit; ComponentLink1Description: https://datasheet.ciiva.com:443/pdfs/VipMasterIC/IC/YAGO/YAGO-S-A0009016998/YAGO-S-A0009016998-1.pdf?src-supplier=IHS+Markit; ComponentLink2URL: https://www.yageo.com/upload/media/product/productsearch/datasheet/rchip/PYu-AF_51_RoHS_L_6.pdf?src-supplier=Digikey; ComponentLink2Description: https://www.yageo.com/upload/media/product/productsearch/datasheet/rchip/PYu-AF_51_RoHS_L_6.pdf?src-supplier=Digikey
R4-R6 R8 R10 = MCS0402MD1002BE100: Resistores de Filme Fino - SMD .063W 10Kohms 0.1% 0402 25ppm Auto; Manufacturer_Name: Vishay; Datasheet Link: http://www.vishay.com/docs/28705/mcx0x0xpro.pdf; Height: 0.37mm; Manufacturer_Part_Number: MCS0402MD1002BE100; Mouser Part Number: 594-MCS0402MD1002BE1; Mouser Price/Stock: https://www.mouser.co.uk/ProductDetail/Vishay-Beyschlag/MCS0402MD1002BE100?qs=3SvaY9RawMIFge2HspqWnA%3D%3D; Arrow Part Number: MCS0402MD1002BE100; Arrow Price/Stock: https://www.arrow.com/en/products/mcs0402md1002be100/vishay?region=nac
R9 = CRCW06033R00JNTA: Fixed Resistor, Metal Glaze/thick Film, 0.1W, 3ohm, 75V, 5% +/-Tol, 200ppm/Cel, Surface Mount, 0603; Manufacturer: Vishay Dale; Manufacturer Series: CRCW; Power: 100mW; Rated Temperature: 70°C; Value: 3R; Temperature Coefficient: 200ppm/°C; Package Height: 0.45mm; Package Length: 1.55mm; Package Width: 0.85mm; Reference Standard: AEC-Q200; Supplier: Mouser; Supplier Part Number: 71-CRCW0603J-3; Manufacturer Part Number: CRCW06033R00JNTA; RoHS: No; Category: Chip SMD Resistors; Stock: 24685; Pricing: 1=0,16, 10=0,111, 50=0,111, 100=0,042, 1000=0,018, 10000=0,013 (USD); Mounting Technology: Surface Mount; Pins: 2; Package Shape: Rectangular; Case/Package: 0603; Terminal Finish: Nickel; Min Operating Temperature: -55°C; Max Operating Temperature: 155°C; Tolerance: 5%; JESD-609 Code: e0; Resistor Type: FIXED RESISTOR; Construction: Chip; Package Style: SMTMeter; Packaging: Tape and Reel; Series: D/CRCW; Technology: METAL GLAZE/THICK FILM; Termination: Wraparound; Working Voltage: 75V; RoHS Compliant: No; Reach SVHC Compliant: No; ComponentLink1URL: https://datasheet.ciiva.com:443/pdfs/VipMasterIC/IC/VISH/VISH-S-A0002183699/VISH-S-A0002183699-1.pdf?src-supplier=IHS+Markit; ComponentLink1Description: https://datasheet.ciiva.com:443/pdfs/VipMasterIC/IC/VISH/VISH-S-A0002183699/VISH-S-A0002183699-1.pdf?src-supplier=IHS+Markit; ComponentLink2URL: https://datasheet.ciiva.com/2563/dcrcw-2563882.pdf?src-supplier=Digikey; ComponentLink2Description: https://datasheet.ciiva.com/2563/dcrcw-2563882.pdf?src-supplier=Digikey; ComponentLink3URL: https://datasheet.ciiva.com/9082/dcrcw-9082586.pdf?src-supplier=Avnet; ComponentLink3Description: https://datasheet.ciiva.com/9082/dcrcw-9082586.pdf?src-supplier=Avnet
R11 R12 = ERJ-PA2F4701X: Thick Film Resistors - SMD 0402 1% 4.7Kohm Anti-Surge AEC-Q200; Manufacturer_Name: Panasonic; Datasheet Link: http://industrial.panasonic.com/cdbs/www-data/pdf/RDO0000/AOA0000C331.pdf; Height: 0.4mm; Manufacturer_Part_Number: ERJ-PA2F4701X; Mouser Part Number: 667-ERJ-PA2F4701X; Mouser Price/Stock: https://www.mouser.co.uk/ProductDetail/Panasonic/ERJ-PA2F4701X?qs=h9NfwcE6J0JdNXujYyUhOg%3D%3D; Arrow Part Number: ERJ-PA2F4701X; Arrow Price/Stock: https://www.arrow.com/en/products/erj-pa2f4701x/panasonic?region=nac
S1-S4 = TL6340AF160Q: Keypad Switch, 1 Switches, SPST, Momentary-tactile, 0.02A, 12VDC, 1.57N, 2 PCB Hole Cnt, Solder Terminal, Surface Mount-right Angle; Manufacturer: E-Switch; Supplier: Mouser; Supplier Part Number: 612-TL6340AF160QG; Manufacturer Part Number: TL6340AF160Q; RoHS: Yes; Category: Tactile Switches; Stock: 2006; Pricing: 1=0,51, 10=0,478, 50=0,478, 100=0,377, 1000=0,313, 10000=0,255 (USD); ComponentLink1URL: https://datasheet.octopart.com/TL6340AF160Q-E-Switch-datasheet-155697155.pdf?src-supplier=Future+Electronics; ComponentLink1Description: https://datasheet.octopart.com/TL6340AF160Q-E-Switch-datasheet-155697155.pdf?src-supplier=Future+Electronics; ComponentLink2URL: https://datasheet.octopart.com/TL6340AF160Q-E-Switch-datasheet-165860010.pdf?src-supplier=TME; ComponentLink2Description: https://datasheet.octopart.com/TL6340AF160Q-E-Switch-datasheet-165860010.pdf?src-supplier=TME
X1 = 4048: Mini SWD 0.05 Pitch Connector - 10 Pin SMT Box Header | Adafruit Industries 4048; Supplier: Mouser; Supplier Part Number: 485-4048; Manufacturer: Adafruit Industries; Manufacturer Part Number: 4048; RoHS: No; Category: Connectors; Stock: 723; Pricing: 1=1,95, 10=1,95, 50=1,95, 100=1,95, 1000=1,95, 10000=1,95 (USD); ComponentLink1URL: https://media.digikey.com/pdf/Data%20Sheets/Adafruit%20PDFs/4048_Web.pdf?src-supplier=Digikey; ComponentLink1Description: https://media.digikey.com/pdf/Data%20Sheets/Adafruit%20PDFs/4048_Web.pdf?src-supplier=Digikey
X2 = SULH-A021T-0.5: Manufacturer: JST; Supplier: Mouser; Supplier Part Number: 306-SULHA021T05; Manufacturer Part Number: SULH-A021T-0.5; RoHS: No; Stock: 156516; Pricing: 1=0,14, 10=0,11, 50=0,11, 100=0,081, 1000=0,059, 10000=0,048 (USD)